# EAGLE design 123_relay_1010 (EAGLE 9.6.2)
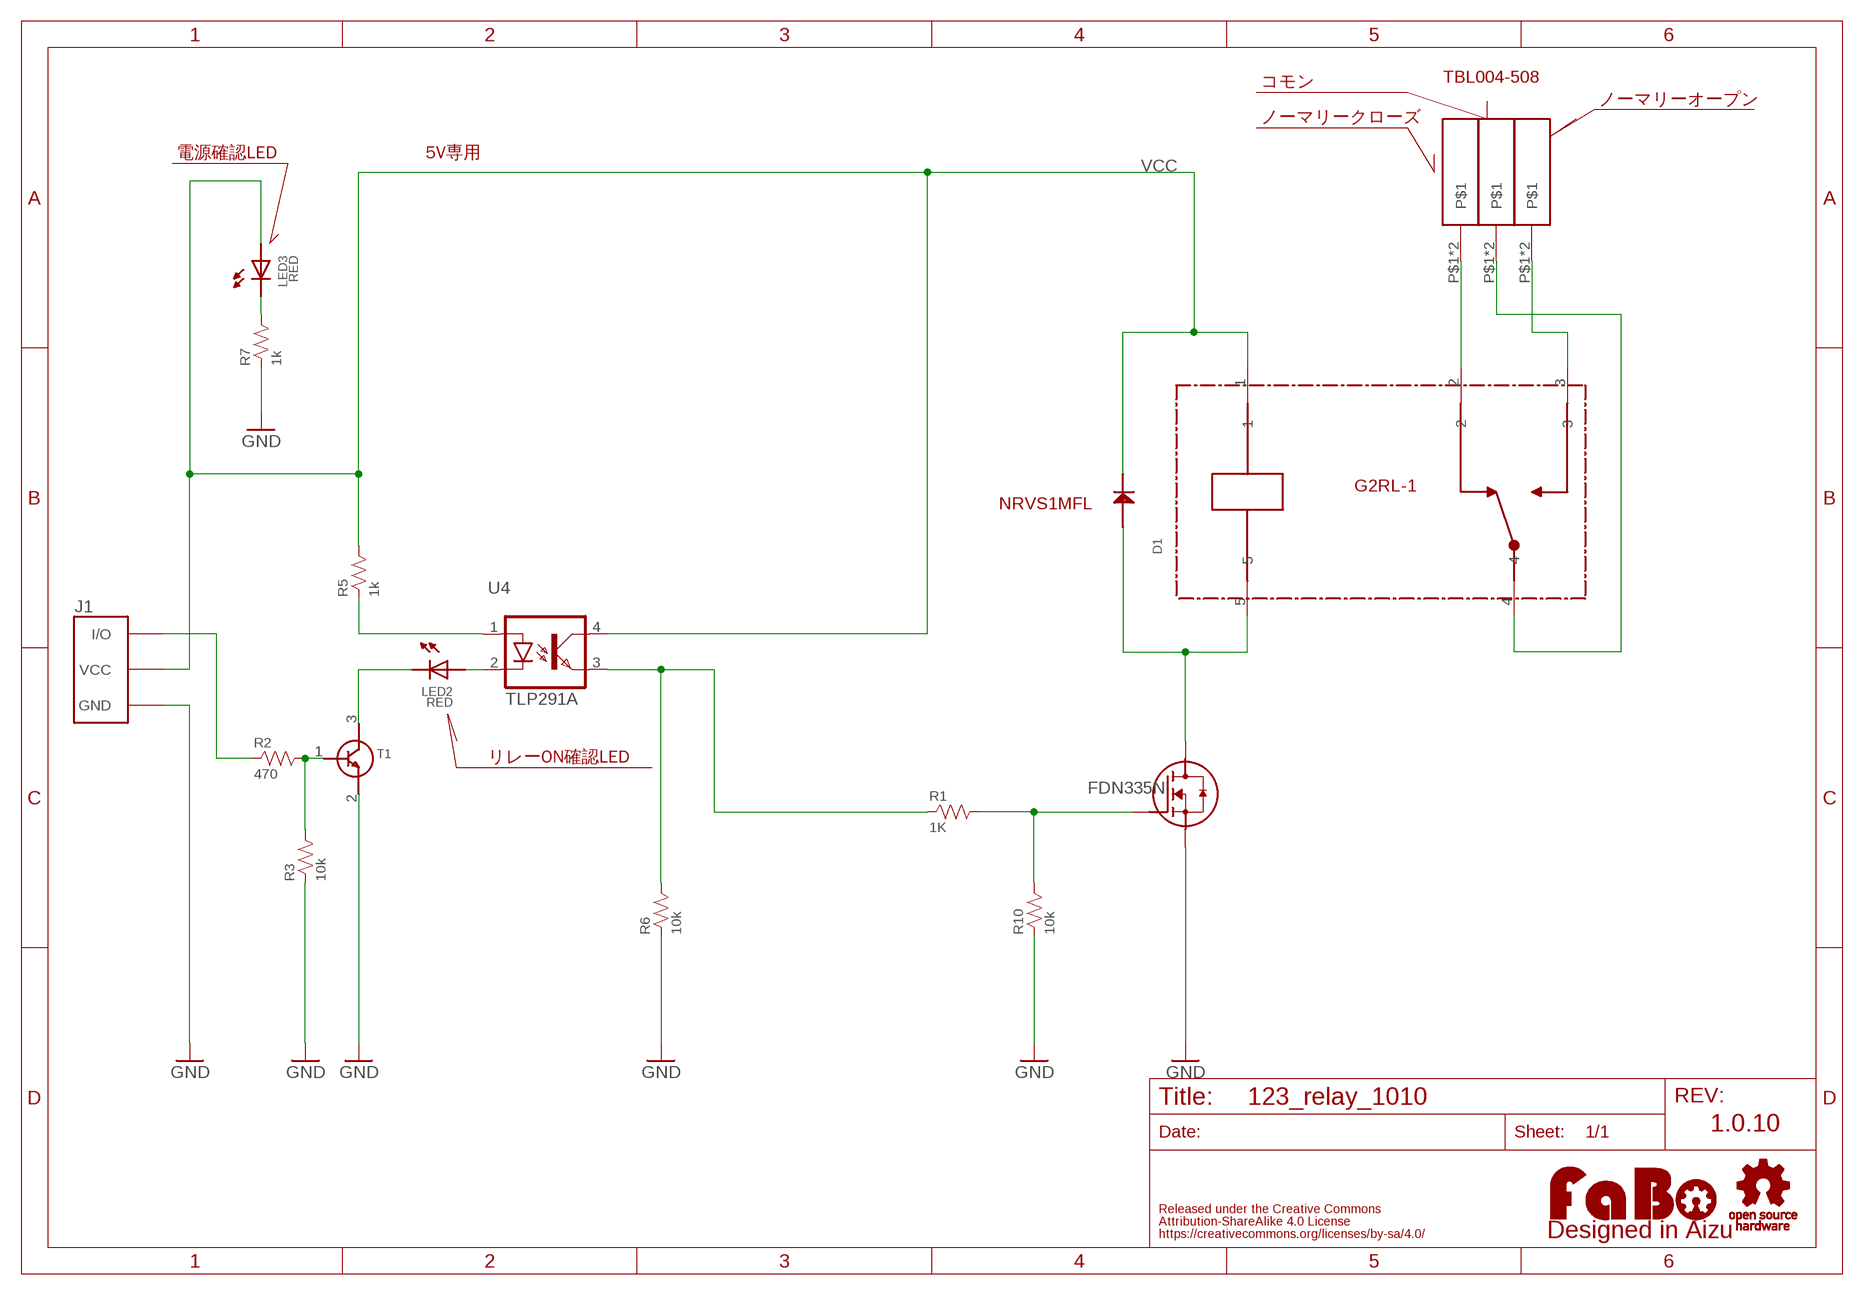
[diagram p0: schematic, sheet 1]

## Parts
D1  NRVS1MFL  [SD-123F]
FET  FDN335N  [FDN335]
J1  FABO_BRICK_3PIN-S03B-PASK-2_LONG  [FABO_BRICK_3PIN_S03B-PASK-2_LONG]
LED2  RED  LED-0603  [0603]
LED3  RED  LED-0603  [0603]
LOGO1  LOGO_FABO-M  [LOGO_FABO_M]
R1  1K  RESISTOR-0603-NARROW  [0603-NARROW]
R2  470  RESISTOR-0603-NARROW  [0603-NARROW]
R3  10k  RESISTOR-0603-NARROW  [0603-NARROW]
R5  1k  RESISTOR-0603-NARROW  [0603-NARROW]
R6  10k  RESISTOR-0603-NARROW  [0603-NARROW]
R7  1k  RESISTOR-0603-NARROW  [0603-NARROW]
R10  10k  RESISTOR-0603-NARROW  [0603-NARROW]
T1  TRANSISTOR-NPN  [SOT-23]
U4  TLP291A  [11-3C1]
U$2  G2RL-1  [G2RL-1]
U$3  TBL004-508  [TBL004-508]
U$4  TBL004-508  [TBL004-508]
U$5  TBL004-508  [TBL004-508]
U$10  LOGO_OSHW-M_BOTTOM  [LOGO_OSHW_M_BOTTOM]

## Nets
GND: FET.2:S(S) J1.GND R3.1 R6.1 R7.1 R10.1 T1.2(E)
N$1: LED2.CATHODE T1.3(C)
N$2: LED2.ANODE U4.2(C)
N$3: R2.2 R3.2 T1.1(B)
N$4: U$2.4 U$4.P$1 U$4.P$2
N$5: R5.1 U4.1(A)
N$6: J1.I/O R2.1
N$7: U$2.2 U$3.P$1 U$3.P$2
N$9: D1.1(ANODE) FET.3:D(D) U$2.5
N$14: R1.1 R6.2 U4.3(EMI)
N$15: U$2.3 U$5.P$1 U$5.P$2
N$17: LED3.CATHODE R7.2
RELAY02: FET.1:G(G) R1.2 R10.2
VCC: D1.2(CATHODE) J1.VCC LED3.ANODE R5.2 U4.4(COL) U$2.1

## Notes on the sheet
- コモン | TBL004-508
- ノーマリーオープン
- ノーマリークローズ
- 電源確認LED | 5V専用
- G2RL-1
- NRVS1MFL
- リレーON確認LED
- 1.0.10

## Library data of the parts
D1 = FaBo-Diode:NRVS1MFL
FET = FaBo-Mosfet:FDN335N
J1 = FaBo-Template:FABO_BRICK_3PIN: FaBo Brick 3pin
LED2 = FaBo-LED:LED; SPICEPREFIX: L
LED3 = FaBo-LED:LED
LOGO1 = component:LOGO_FABO
R1 R6 R7 R10 = FaBo-Resistors:RESISTOR: RESISTOR
R2 R3 R5 = FaBo-Resistors:RESISTOR: RESISTOR; SPICEPREFIX: R
T1 = FaBo-Transistor:TRANSISTOR
U4 = FaBo_Photocoupler:TLP291A
U$2 = FaBo-Relay:G2RL-1
U$3-U$5 = FaBo-Terminal:TBL004-508
U$10 = component:LOGO_OSHW

## Board
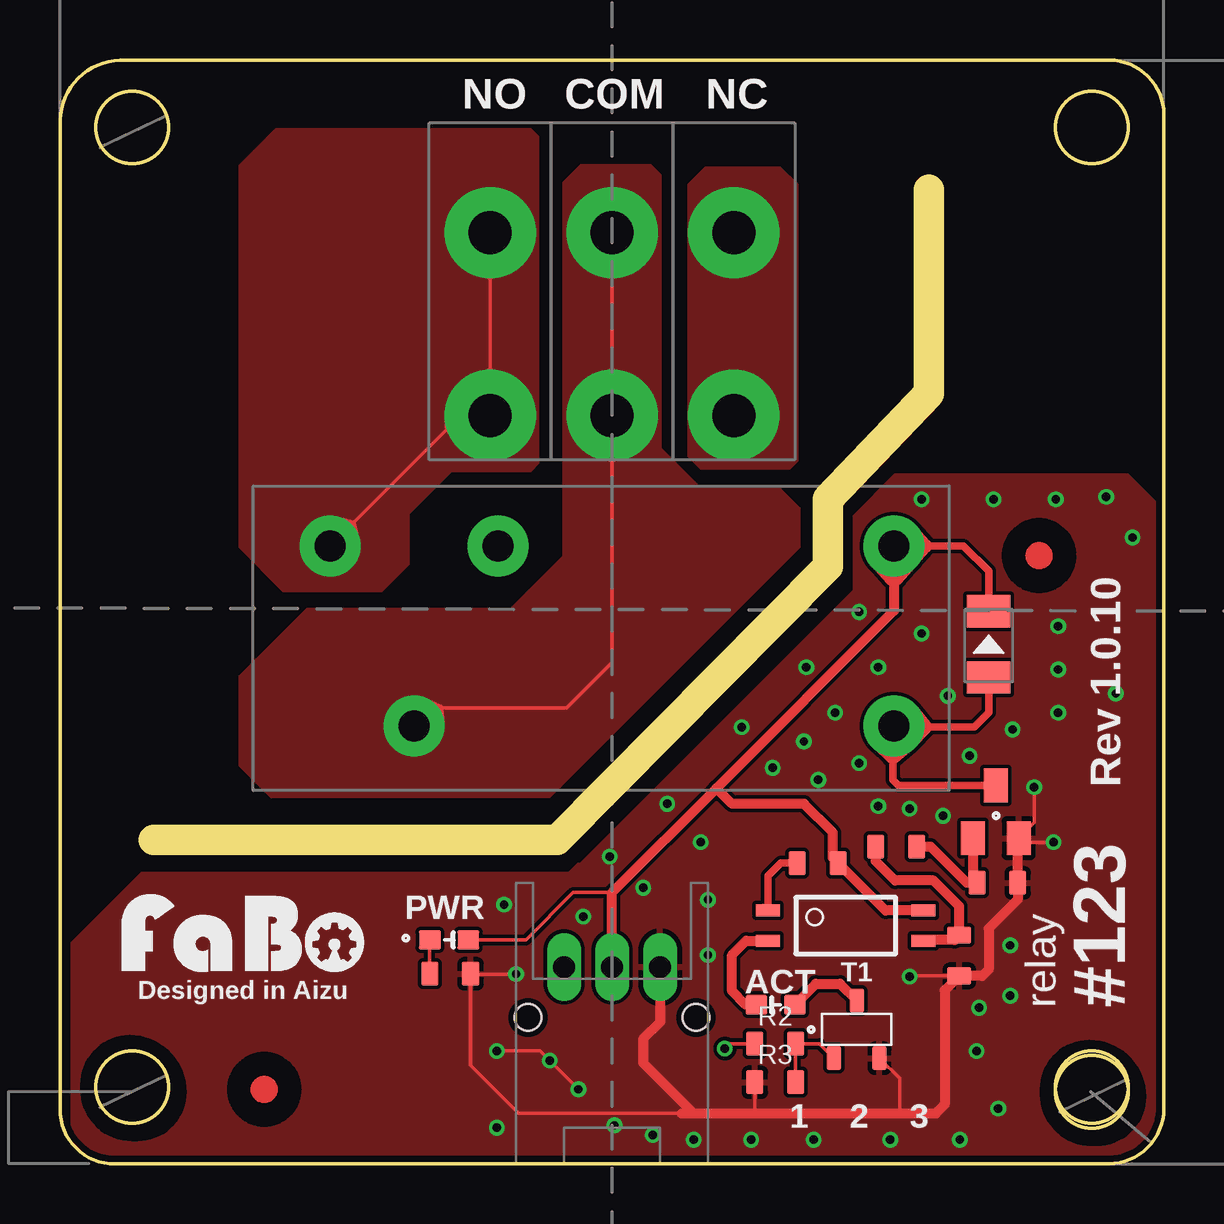
[diagram p1: board, top side]
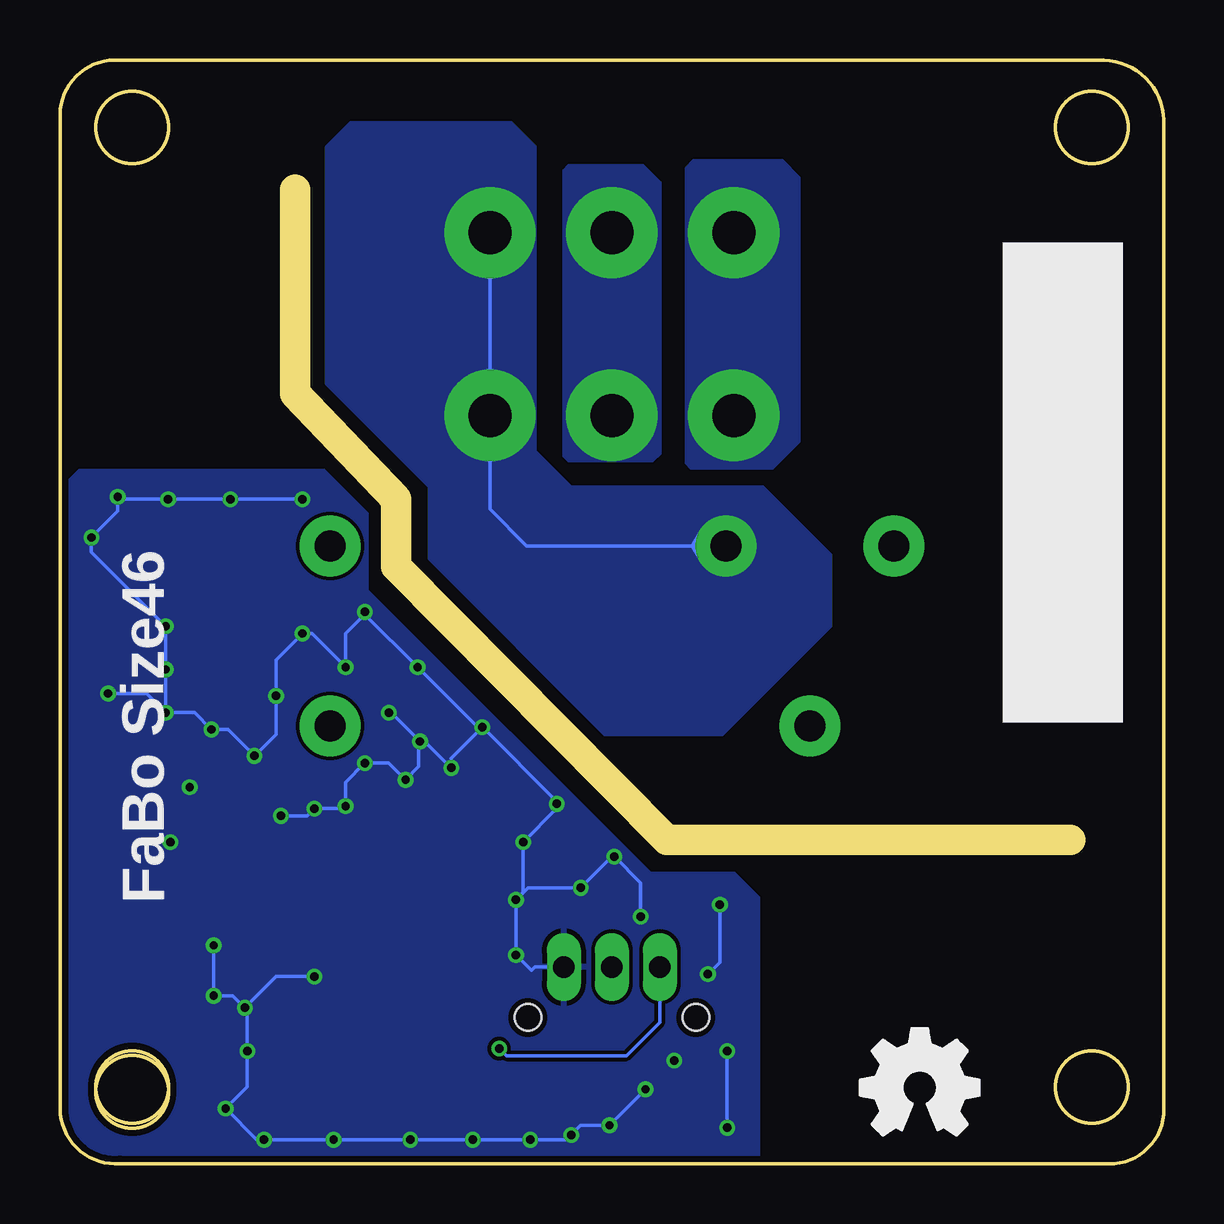
[diagram p2: board, bottom side, seen from below]

Size 46.02 x 46.02 mm. Coordinates in mm from the lower left corner, seen from the top.
Outline: 0.01,2.51 0.01,43.51 arc-87 2.51,46.01 43.51,46.01 arc-100 46.01,43.51 46.01,2.51 arc-99 43.51,0.01 2.51,0.01 arc-102 0.01,2.51
Outline: circle at 3.01,3.21 radius 1.5
Outline: circle at 43.01,3.21 radius 1.5
Outline: circle at 43.01,43.21 radius 1.5
Outline: circle at 3.01,43.21 radius 1.5
Outline: circle at 3.01,3.21 radius 1.5
Outline: circle at 43.01,3.01 radius 1.5
Copper layers (1*16): Top 0.035mm / dielectric 1.6mm / Bottom 0.035mm
Design rules "PCBway": minimum track width 6mil, minimum drill 12mil, track to track 6mil, track to pad 6mil, pad to pad 6mil, via to via 6mil, smd to smd 6mil, copper to edge 10mil, drill to drill 10mil, minimum pad ring 10mil, minimum via ring 6mil, stop-mask expansion 2mil, vias tented up to drill 100mil, thermal gap 8mil
tRestrict: area 0.9,1 to 5.2,5.3; area 40.9,0.8 to 45.2,5.1
Milling: 5 lines

### Footprints (pad centres in the part's own frame; a part is rotated, then mirrored left to right if it is on the bottom)
SD-123F = smd 1.34 x 1.8: 1 -1.33,0; 2 1.43,0
FDN335 = smd 1 x 1.4: 1:G -0.95,-2.2; 2:S 0.95,-2.2; 3:D 0,0
FABO_BRICK_3PIN_S03B-PASK-2_LONG = drill 0.9 pad 1.422 long: GND -2,0; I/O 2,0; VCC 0,0 | hole 1.1: 3.5,2.1; -3.5,2.1
0603 = smd 0.9 x 0.8: ANODE -0.8,0; CATHODE 0.8,0
0603-NARROW = smd 0.71 x 1: 1 -0.85,0; 2 0.85,0
SOT-23 = smd 0.6 x 1: 1 -0.95,-1.2; 2 0.95,-1.2; 3 0,1.2
11-3C1 = smd 1 x 0.5: 1 -3.24,0.635; 2 -3.24,-0.635; 3 3.24,-0.635; 4 3.24,0.635
G2RL-1 = drill 1.3 pad 2.54: 1 -11.75,-3.75; 2 4.75,-3.75; 3 11.75,-3.75; 4 8.25,3.75; 5 -11.75,3.75
TBL004-508 = drill 1.8 pad 3.81: P$1 0,3.81; P$2 0,-3.81

### Placement (x,y rotation side)
D1  38.71,21.61 90 top
FET  39.01,15.78 0 top
J1  23.01,8.21 180 top
LED2  29.83,6.64 0 top
LED3  16.22,9.34 180 top
LOGO1  7.63,7.63 0 top
R1  34.85,13.22 0 top
R2  29.81,5.01 0 top
R3  29.81,3.41 0 top
R5  31.58,12.55 0 top
R6  37.48,8.69 90 top
R7  16.26,7.93 180 top
R10  39.07,11.72 180 top
T1  33.21,5.61 0 top
U4  32.75,9.94 0 top
U$2  23.01,22.01 180 top
U$3  28.09,35.01 180 top
U$4  23.01,35.01 180 top
U$5  17.93,35.01 180 top
U$10  10.17,3.19 0 top
U$11  [MARK_POINT_3MM]  40.81,25.36 0 top
U$12  [MARK_POINT_3MM]  8.51,3.11 0 top

### Tracks (layer width: path | path; a pad name or v marks a point on that pad's centre or on a via)
GND  (via drill 0.35)
  Top 0.152: 25.91,2.11 19.11,2.11 17.11,4.11 R7.1 17.13,7.91 v19.01,7.91 | v18.21,4.71 20.01,4.71 v20.41,4.31 v21.61,3.11 | FET.2:S 40.61,14.23 v40.61,15.71 | v41.41,13.41 40.13,13.41 40.08,13.46 | R3.1 28.96,2.26 28.81,2.11 | T1.2 35.01,3.56 35.01,2.11 | v35.41,7.81 35.44,7.84 R6.1
  Top 0.406: FET.2:S 39.92,13.54 R10.1 39.92,11.02 38.71,9.81 38.71,8.11 38.44,7.84 R6.1 36.88,7.24 36.88,2.48 36.51,2.11 35.01,2.11 28.81,2.11 26.41,2.11 | J1.GND 25.01,5.91 24.31,5.21 24.31,4.21 26.41,2.11 | 25.91,2.11 26.41,2.11
  Top 0.508: 40.08,13.46 FET.2:S
  Bottom 0.152: v18.21,4.71 v18.21,1.51 | v21.61,3.11 v23.11,1.61 24.31,1.61 v24.71,1.21 24.91,1.01 v26.41,1.01 v28.81,1.01 v31.41,1.01 v34.61,1.01 v37.51,1.01 37.81,1.01 v39.11,2.31 38.21,3.21 v38.21,4.71 38.21,6.41 v38.31,6.51 | v19.01,7.91 18.51,8.41 v18.51,10.81 | v21.81,10.31 21.81,11.71 v22.91,12.81 23.01,12.81 v24.31,11.51 26.51,11.51 v27.01,11.01 | v27.01,11.01 26.71,11.31 v26.71,13.41 25.31,14.81 v25.31,15.01 25.31,15.11 v28.41,18.21 | v27.01,11.01 v27.01,8.71 26.37,8.07 26.23,8.21 J1.GND | v35.41,7.81 37.01,7.81 v38.31,6.51 | v38.31,6.51 38.81,7.01 v39.61,7.01 v39.61,9.11 | v35.91,27.71 v38.91,27.71 v41.51,27.71 43.51,27.71 v43.61,27.81 43.61,27.21 v44.71,26.11 44.71,25.51 v41.61,22.41 v41.61,20.61 41.61,18.91 41.66,18.86 | 33.31,22.91 v31.11,20.71 28.61,18.21 v28.41,18.21 | 33.31,22.91 v33.31,23.01 | v28.41,18.21 29.71,16.91 v29.71,16.51 30.81,17.61 v31.01,17.61 | v31.01,17.61 31.06,17.66 31.06,16.56 v31.61,16.01 32.31,16.71 v33.31,16.71 34.11,15.91 v34.11,14.91 34.21,14.81 v35.41,14.81 35.71,14.51 v36.81,14.51 | v31.01,17.61 32.21,18.81 v32.31,18.81 | 33.31,22.91 34.11,22.11 v34.11,20.71 35.51,22.11 v35.91,22.11 37.01,21.01 v37.01,19.51 37.01,17.91 v37.91,17.01 39.01,18.11 v39.71,18.11 40.41,18.81 v41.61,18.81 41.66,18.86 | 41.66,18.86 42.41,19.61 v44.01,19.61
  pour Top: 0.51,-1.29 0.51,9.21 3.41,12.11 21.21,12.11 21.61,12.51 21.61,12.41 33.11,23.91 33.11,27.01 34.81,28.71 44.51,28.71 46.81,26.41 46.81,25.01 46.91,24.91 46.91,-0.09 45.71,-1.29
  pour Bottom: 16.91,-1.09 16.91,11.11 17.91,12.11 21.41,12.11 33.21,23.91 33.21,27.11 35.01,28.91 45.21,28.91 47.11,27.01 47.11,-0.59 46.61,-1.09
N$1
  Top 0.406: LED2.CATHODE 31.5,7.51 32.51,7.51 T1.3
N$2
  Top 0.406: LED2.ANODE 28.58,6.64 28.01,7.21 28.01,8.71 28.6,9.3 U4.2
N$3
  Top 0.152: R3.2 R2.2 31.66,5.01 T1.1
N$4
  Top 0.152: U$2.4 15.51,19.01 15.82,19.01 21.11,19.01 23.01,20.91 23.01,29.4 U$4.P$1 23.01,33 23.01,37.02 U$4.P$2
  Top 0.305: U$4.P$1 23.41,29.5 23.01,29.4 22.61,29.5 U$4.P$1 | U$4.P$1 22.61,32.91 23.01,33 23.41,32.91 U$4.P$1 | 23.01,37.02 23.41,37.12 U$4.P$2 22.61,37.12 23.01,37.02 | 15.82,19.01 15.22,19.28 U$2.4 15.88,18.35 15.82,19.01
  pour Bottom (no thermals): 21.01,40.91 21.01,40.91 21.71,41.61 24.81,41.61 25.01,41.41 25.01,29.51 24.81,29.31 21.31,29.31 21.01,29.61
  pour Top (no thermals): 7.51,16.61 7.51,20.31 10.31,23.11 18.81,23.11 21.01,25.31 21.01,40.91 21.71,41.61 24.61,41.61 25.01,41.21 25.01,29.81 26.61,28.21 29.91,28.21 30.81,27.31 30.81,25.71 20.41,15.31 8.81,15.31
N$5
  Top 0.152: 29.31,10.77 U4.1
  Top 0.305: U4.1 29.51,12.01 30.05,12.55 R5.1
N$6  (via drill 0.35)
  Top 0.152: R2.1 27.91,5.01 v27.71,4.81
  Bottom 0.152: v27.71,4.81 27.41,4.51 22.41,4.51 21.01,5.91 J1.I/O
N$7
  Bottom 0.152: U$2.2 19.56,25.76 26.56,25.76 28.09,27.29 28.09,29.4 U$3.P$1 28.09,33 28.09,37.02 U$3.P$2
  Bottom 0.305: U$3.P$1 28.49,29.5 28.09,29.4 27.69,29.5 U$3.P$1 | U$3.P$1 27.69,32.91 28.09,33 28.49,32.91 U$3.P$1 | 28.09,37.02 28.49,37.12 U$3.P$2 27.69,37.12 28.09,37.02 | 19.56,25.76 19.22,26.33 U$2.2 19.22,25.19 19.56,25.76
  pour Top (no thermals): 26.21,40.81 26.91,41.51 30.01,41.51 30.71,40.81 30.71,29.31 30.41,29.01 26.71,29.01 26.21,29.51
  pour Bottom (no thermals): 13.91,22.41 13.91,25.41 16.71,28.21 24.71,28.21 26.21,29.71 26.21,42.41 27.21,43.41 33.91,43.41 34.91,42.41 34.91,32.51 30.61,28.21 30.61,25.21 23.31,17.91 18.41,17.91
N$9
  Top 0.305: D1.1 38.71,18.81 38.11,18.21 36.06,18.21 34.81,18.21 | 34.81,18.21 U$2.5 | FET.3:D 34.94,15.78 34.71,16.01 34.71,16.96 34.71,18.11 34.81,18.21
  Top 0.61: U$2.5 35.5,18.88 36.06,18.21 35.45,17.59 U$2.5 | U$2.5 35.38,17.52 34.71,16.96 34.09,17.57 U$2.5
N$14
  Top 0.406: U4.3 36.03,9.34 37.28,9.34 R6.2 37.48,10.74 36.41,11.81 34.81,11.81 34,12.62 R1.1
N$15
  Top 0.152: U$2.3 12.18,26.68 16.2,30.7 16.7,31.2 17.91,31.2 | 17.91,31.2 U$5.P$1 | U$5.P$2 17.93,37.02 17.93,33 17.93,31.22 17.91,31.2
  Top 0.305: U$5.P$1 16.4,30.34 16.2,30.7 16.18,31.11 U$5.P$1 | U$5.P$1 17.53,32.91 17.93,33 18.33,32.91 U$5.P$1 | 17.93,37.02 18.33,37.12 U$5.P$2 17.53,37.12 17.93,37.02 | 12.18,26.68 11.54,26.84 U$2.3 12.34,26.04 12.18,26.68
  pour Top (no thermals): 9.31,23.91 7.51,25.71 7.51,41.61 9.01,43.11 19.61,43.11 19.91,42.81 19.91,29.21 19.61,28.91 16.31,28.91 14.51,27.11 14.51,25.01 13.41,23.91
  pour Bottom (no thermals): 16.31,29.01 15.21,30.11 15.21,41.11 15.91,41.81 19.61,41.81 19.91,41.51 19.91,29.21 19.71,29.01
N$17
  Top 0.152: R7.2 LED3.CATHODE
RELAY02
  Top 0.152: R1.2 35.82,13.22
  Top 0.406: R1.2 36.3,13.22 37.8,11.72 R10.2 38.06,11.88 FET.1:G
VCC
  Top 0.152: LED3.ANODE 19.42,9.34 21.39,11.31 23.01,11.31
  Top 0.305: D1.2 38.71,24.71 37.66,25.76 36.06,25.76 U$2.1
  Top 0.406: 34.46,25.76 U$2.1 34.76,24.46 34.76,23.06 27.36,15.66 | J1.VCC 23.01,11.31 27.36,15.66 | U4.4 34.41,10.57 R5.2 32.21,12.77 32.21,13.81 31.01,15.01 28.01,15.01 27.36,15.66
  Top 0.61: 36.06,25.76 35.48,26.41 U$2.1 35.48,25.11 36.06,25.76
  Top 0.813: 34.76,24.46 35.41,25.19 U$2.1 34.12,25.19 34.76,24.46

### Text on the board
tPlace: NO | COM | NC | Rev 1.0.10 | PWR | Designed in Aizu | ACT | relay | #123 | 1 | 2 | 3
bPlace: FaBo Size46
tDocu: FaBo Brick New Size Type 46 / 寸法図 | Insertside | R-2.5